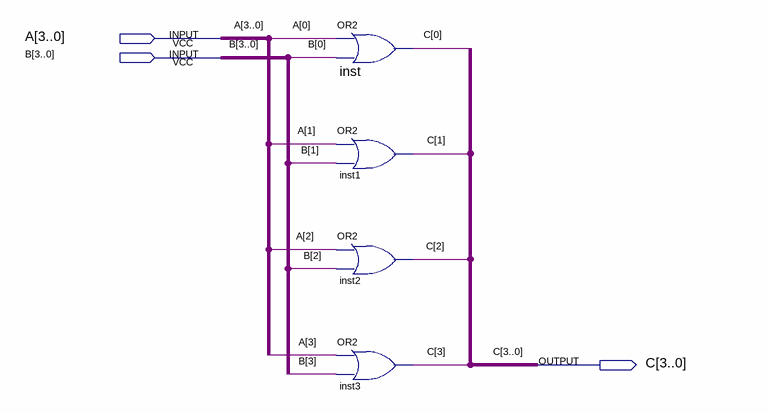
[diagram p0: schematic sheet]
// Quartus schematic or4impl.bdf as structural Verilog: 4 symbols, 3 pins
module or4impl (
  input  [3:0] A,
  input  [3:0] B,
  output [3:0] C
);

  or inst (C[0], A[0], B[0]);
  or inst1 (C[1], A[1], B[1]);
  or inst2 (C[2], A[2], B[2]);
  or inst3 (C[3], A[3], B[3]);
endmodule
